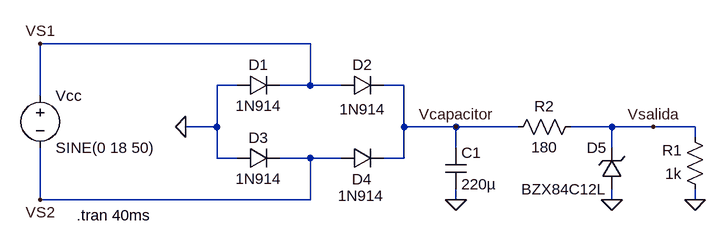
[diagram p0: schematic Punto 3.asc]
Punto 3.asc, the LTspice schematic file:
Version 4
SHEET 1 1748 680
WIRE 1120 176 704 176
WIRE 1008 240 976 240
WIRE 1120 240 1120 176
WIRE 1120 240 1072 240
WIRE 1168 240 1120 240
WIRE 1264 240 1232 240
WIRE 704 256 704 176
WIRE 976 304 976 240
WIRE 976 304 928 304
WIRE 1264 304 1264 240
WIRE 1344 304 1264 304
WIRE 1440 304 1344 304
WIRE 1584 304 1520 304
WIRE 1648 304 1584 304
WIRE 1712 304 1648 304
WIRE 1712 320 1712 304
WIRE 1344 336 1344 304
WIRE 1584 336 1584 304
WIRE 976 352 976 304
WIRE 1008 352 976 352
WIRE 1120 352 1072 352
WIRE 1168 352 1120 352
WIRE 1264 352 1264 304
WIRE 1264 352 1232 352
WIRE 704 416 704 336
WIRE 1120 416 1120 352
WIRE 1120 416 704 416
WIRE 1344 416 1344 400
WIRE 1584 416 1584 400
WIRE 1712 416 1712 400
FLAG 928 304 0
FLAG 1712 416 0
FLAG 704 176 VS1
FLAG 704 416 VS2
FLAG 1648 304 Vsalida
FLAG 1344 416 0
FLAG 1584 416 0
FLAG 1344 304 Vcapacitor
SYMBOL voltage 704 240 R0
WINDOW 123 0 0 Left 0
WINDOW 39 0 0 Left 0
SYMATTR InstName Vcc
SYMATTR Value SINE(0 18 50)
SYMBOL diode 1008 256 R270
WINDOW 0 32 32 VTop 2
WINDOW 3 0 32 VBottom 2
SYMATTR InstName D1
SYMATTR Value 1N914
SYMBOL diode 1168 256 R270
WINDOW 0 32 32 VTop 2
WINDOW 3 -5 32 VBottom 2
SYMATTR InstName D2
SYMATTR Value 1N914
SYMBOL diode 1008 368 R270
WINDOW 0 32 32 VTop 2
WINDOW 3 0 32 VBottom 2
SYMATTR InstName D3
SYMATTR Value 1N914
SYMBOL diode 1168 368 R270
WINDOW 0 -32 31 VTop 2
WINDOW 3 -26 30 VBottom 2
SYMATTR InstName D4
SYMATTR Value 1N914
SYMBOL res 1728 416 R180
WINDOW 0 36 76 Left 2
WINDOW 3 36 40 Left 2
SYMATTR InstName R1
SYMATTR Value 1k
SYMBOL cap 1328 336 R0
SYMATTR InstName C1
SYMATTR Value 220µ
SYMBOL res 1536 288 R90
WINDOW 0 0 56 VBottom 2
WINDOW 3 32 56 VTop 2
SYMATTR InstName R2
SYMATTR Value 180
SYMBOL zener 1600 400 R180
WINDOW 0 24 64 Left 2
WINDOW 3 24 0 Left 2
SYMATTR InstName D5
SYMATTR Value BZX84C12L
TEXT 760 440 Left 2 !.tran 40ms

The netlist it stands for:
* Punto 3.asc
Vcc VS1 VS2 SINE(0 18 50)
D1 0 VS1 1N914
D2 VS1 Vcapacitor 1N914
D3 0 VS2 1N914
D4 VS2 Vcapacitor 1N914
R1 0 Vsalida 1k
C1 Vcapacitor 0 220µ
R2 Vsalida Vcapacitor 180
D5 0 Vsalida BZX84C12L
.model D D
.lib standard.dio
.tran 40ms
.backanno
.end

* Results of the author's LTspice run, read from the files saved beside the schematic
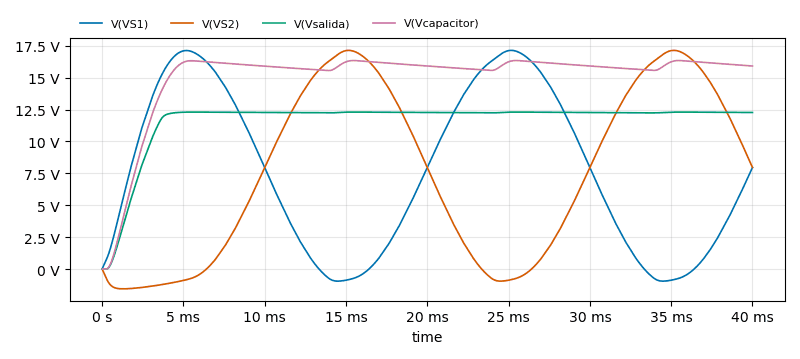
[diagram p1: Transient Analysis of Punto 3.asc, plotted from the saved traces]
* Transient Analysis, 1 run:
*   V(VS1): min -950.3 mV, max 17.14 V, average 7.55 V, rms 9.856 V, last 7.958 V
*   V(VS2): min -1.55 V, max 17.14 V, average 7.55 V, rms 10.15 V, last 7.958 V
*   V(Vsalida): min 0 V, max 12.3 V, average 11.66 V, rms 11.88 V, last 12.27 V
*   V(Vcapacitor): min 0 V, max 16.35 V, average 15.1 V, rms 15.41 V, last 15.92 V